# Altium schematic sheet Brightside_Telemetry_RC_rev2.SchDoc
size A4
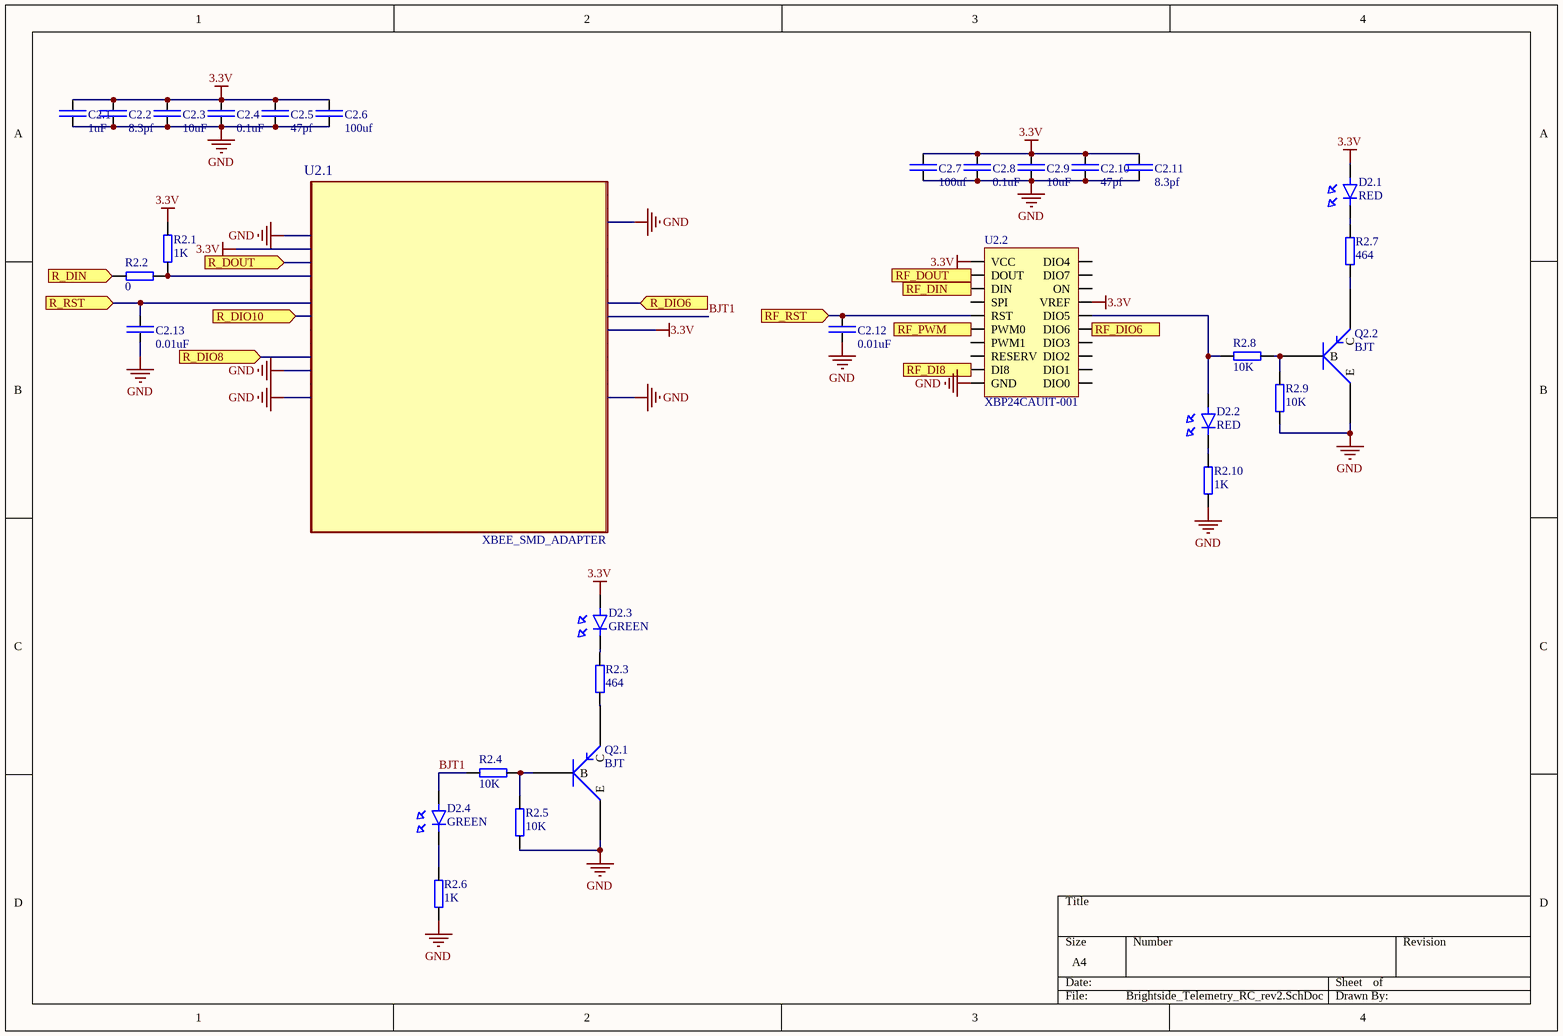
[diagram p0: Brightside_Telemetry_RC_rev2.SchDoc]

## Parts
C2.1  1uF  [C0805]
C2.2  8.3pf  [0603]
C2.3  10uF  [C0805]
C2.4  0.1uF  [0805]
C2.5  47pf  [0603]
C2.6  100uf  [1206]
C2.7  100uf  [1206]
C2.8  0.1uF  [0805]
C2.9  10uF  [C0805]
C2.10  47pf  [0603]
C2.11  8.3pf  [0603]
C2.12  0.01uF  [0805]
C2.13  0.01uF  [0805]
D2.1  RED  [0603 LED]
D2.2  RED  [0603 LED]
D2.3  GREEN  [0603 LED]
D2.4  GREEN  [0603 LED]
Q2.1  BJT  [SOT-23-3]
Q2.2  BJT  [SOT-23-3]
R2.1  1K  [R0805]
R2.2  0  [0805]
R2.3  464  [R0805]
R2.4  10K  [R0805]
R2.5  10K  [R0805]
R2.6  1K  [R0805]
R2.7  464  [R0805]
R2.8  10K  [R0805]
R2.9  10K  [R0805]
R2.10  1K  [R0805]
U2.1  XBEE_SMD_ADAPTER  [XBEE_RF_ADAPT]
U2.2  XBP24CAUIT-001  [XBEE_RF]

## Ports
R_DIN (in), R_DIO6 (in), R_DIO8 (in), R_DIO10 (in), R_DOUT (in), R_RST (in), RF_DI8 (in), RF_DIN (in), RF_DIO6 (in), RF_DOUT (in), RF_PWM (in), RF_RST (in)

## Nets
3.3V: C2.1.2 C2.2.2 C2.3.2 C2.4.2 C2.5.1 C2.6.2 C2.7.2 C2.8.1 C2.9.2 C2.10.2 C2.11.2 D2.1.2 D2.3.2 R2.1.2 U2.1.2(P$2) U2.1.27(P$27) U2.2.1(VCC) U2.2.14(VREF)
GND: C2.1.1 C2.2.1 C2.3.1 C2.4.1 C2.5.2 C2.6.1 C2.7.1 C2.8.2 C2.9.1 C2.10.1 C2.11.1 C2.12.2 C2.13.1 Q2.1.3(E) Q2.2.3(E) R2.5.1 R2.6.1 R2.9.1 R2.10.1 U2.1.1(P$1) U2.1.11(P$11) U2.1.13(P$13) U2.1.22(P$22) U2.1.35(P$35) U2.2.10(GND)
BJT1: D2.4.2 R2.4.1 U2.1.28(P$28)
R_DIN: R2.2.1 ; port R_DIN
R_DIO6: U2.1.29(P$29) ; port R_DIO6
R_DIO8: U2.1.10(P$10) ; port R_DIO8
R_DIO10: U2.1.7(P$7) ; port R_DIO10
R_DOUT: U2.1.3(P$3) ; port R_DOUT
R_RST: C2.13.2 U2.1.6(P$6) ; port R_RST
RF_DI8: U2.2.9(DI8) ; port RF_DI8
RF_DIN: U2.2.3(DIN) ; port RF_DIN
RF_DIO6: U2.2.16(DIO6) ; port RF_DIO6
RF_DOUT: U2.2.2(DOUT) ; port RF_DOUT
RF_PWM: U2.2.6(PWM0) ; port RF_PWM
RF_RST: C2.12.1 U2.2.5(RST) ; port RF_RST
NetD2.1_1: D2.1.1 R2.7.2
NetD2.2_1: D2.2.1 R2.10.2
NetD2.2_2: D2.2.2 R2.8.1 U2.2.15(DIO5)
NetD2.3_1: D2.3.1 R2.3.2
NetD2.4_1: D2.4.1 R2.6.2
NetQ2.1_1: Q2.1.1(B) R2.4.2 R2.5.2
NetQ2.1_2: Q2.1.2(C) R2.3.1
NetQ2.2_1: Q2.2.1(B) R2.8.2 R2.9.2
NetQ2.2_2: Q2.2.2(C) R2.7.1
NetR2.1_1: R2.1.1 R2.2.2 U2.1.4(P$4)

Not connected (* = marked no-connect by the designer): U2.1 5(P$5) 8(P$8) 9(P$9) 12(P$12) 14(P$14) 15(P$15) 16(P$16) 17(P$17) 18(P$18) 19(P$19) 20(P$20) 21(P$21) 23(P$23) 24(P$24) 25(P$25) 26(P$26) 30(P$30) 31(P$31) 32(P$32) 33(P$33) 34(P$34) 36(P$36) 37(P$37); U2.2 4(SPI) 7(PWM1) 8(RESERV) 11(DIO4) 12(DIO7) 13(ON) 17(DIO3) 18(DIO2) 19(DIO1) 20(DIO0)

## Library data of the parts
C2.1 = CL21B105KAFNNNE: Cap Ceramic 1uF 25V X7R 10% SMD 0805 125C T/R; Manufacturer: Samsung; Supplier 1: Digi-Key; Supplier Part Number 1: 1276-1066-1-ND; Manufacturer Part Number: CL21B105KAFNNNE; Stock 1: 1606570; Pricing 1: 1 = 0.10000, 10 = 0.07600, 100 = 0.03380, 500 = 0.02416, 1000 = 0.01898 (USD); RoHS: Yes; Mount: Surface Mount; Case/Package: 0805; Contact Plating: Tin; Case Code (Metric): 2012; Case Code (Imperial): 0805; Min Operating Temperature: -55°C; Max Operating Temperature: 125°C; Packaging: Tape and Reel; Package Quantity: 1; Capacitance: 1uF; Tolerance: 10%; Voltage Rating: 25V; Dielectric: X7R; Voltage: 25V; Voltage Rating (DC): 25V; Length: 2mm; Height: 1.25mm; Depth: 1.25mm; Width: 0.049inch; Thickness: 0.053inch; Radiation Hardening: No; Lead Free: Lead Free; ComponentLink1URL: https://datasheet.ciiva.com/25800/cl21b105kafnnne-25800163.pdf?src-supplier=Digi-Key; ComponentLink1Description: https://datasheet.ciiva.com/25800/cl21b105kafnnne-25800163.pdf?src-supplier=Digi-Key; ComponentLink2URL: https://datasheet.ciiva.com/15195/getdatasheetpartid-355205-15195880.pdf?src-supplier=Verical; ComponentLink2Description: https://datasheet.ciiva.com/15195/getdatasheetpartid-355205-15195880.pdf?src-supplier=Verical; Category: Capacitors
C2.2 C2.11 = CBR06C839BAGAC: CAP CER RF 8.3PF 250V +/-0.1 PF; Manufacturer: KEMET; Supplier 1: Digi-Key; Manufacturer Part Number: CBR06C839BAGAC; RoHS: No; Category: Ceramic Capacitors; Stock 1: 2499; Pricing 1: 1=0.93000, 10=0.68500, 100=0.46970, 500=0.37184, 1000=0.31312 (USD); Supplier Part Number 1: 399-16262-1-ND
C2.3 C2.9 = C0805C106K8PACTU: CAP CER 10UF 10V X5R 0805; Manufacturer: Samsung; Manufacturer Part Number: CL21B105KAFNNNE; Capacitance: 1uF; Tolerance: 10%; Voltage Rating: 25V; Dielectric: X7R; RoHS: Yes; Mount: Surface Mount; Case/Package: 0805; Contact Plating: Tin; Case Code (Metric): 2012; Case Code (Imperial): 0805; Min Operating Temperature: -55°C; Max Operating Temperature: 125°C; Packaging: Tape and Reel; Package Quantity: 1; Voltage: 25V; Voltage Rating (DC): 25V; Length: 2mm; Height: 1.25mm; Depth: 1.25mm; Width: 0.049inch; Thickness: 0.053inch; Radiation Hardening: No; Lead Free: Lead Free; Category: Capacitors; ComponentLink1Description: https://www.digikey.ca/product-detail/en/kemet/C0805C106K8PACTU/399-4925-1-ND/1090920; ComponentLink1URL: https://www.digikey.ca/product-detail/en/kemet/C0805C106K8PACTU/399-4925-1-ND/1090920; Supplier 1: Digi-Key; Supplier Part Number 1: 399-4925-1-ND
C2.4 C2.8 = CL21B104MBCNNNC: Cap Ceramic 0.1uF 50V X7R 20% SMD 0805 125C Paper T/R; Manufacturer: Samsung; Capacitance: 100nF; Supplier 1: Newark; Supplier Part Number 1: 82AC9432; Manufacturer Part Number: CL21B104MBCNNNC; RoHS: Yes; Category: Ceramic Capacitors; Stock 1: 64000; Pricing 1: 4000=0.01100, 8000=0.01000 (CAD); Mount: Surface Mount; Case/Package: 0805; Case Code (Imperial): 0805; Case Code (Metric): 2012; Min Operating Temperature: -55°C; Max Operating Temperature: 125°C; Tolerance: 20%; Dielectric: X7R; Voltage: 50V; Package Quantity: 1; Packaging: Tape and Reel; Voltage Rating: 50V; Voltage Rating (DC): 50V; Length: 2mm; Height: 0.85mm; Depth: 1.25mm; Width: 0.049inch; Thickness: 0.037inch; Radiation Hardening: No; Lead Free: Lead Free; ComponentLink1URL: https://datasheet.ciiva.com/16428/cl21b104mbcnnnc-16428869.pdf?src-supplier=Future+Electronics; ComponentLink1Description: https://datasheet.ciiva.com/16428/cl21b104mbcnnnc-16428869.pdf?src-supplier=Future+Electronics; ComponentLink2URL: https://datasheet.ciiva.com/26838/getdatasheetpartid-746552-26838664.pdf?src-supplier=Verical; ComponentLink2Description: https://datasheet.ciiva.com/26838/getdatasheetpartid-746552-26838664.pdf?src-supplier=Verical; ComponentLink3URL: https://datasheet.ciiva.com/25780/cl21b104mbcnnnc-25780224.pdf?src-supplier=Digi-Key; ComponentLink3Description: https://datasheet.ciiva.com/25780/cl21b104mbcnnnc-25780224.pdf?src-supplier=Digi-Key
C2.5 C2.10 = C0603C470J1GACTU: CAP CER 47PF 100V C0G/NP0 0603; Manufacturer: KEMET; Dielectric Material: Ceramic; Tolerance: 5%; Dielectric: C0G; Temperature Coefficient: 30ppm/°C; Dissipation Factor: 0.1%; Supplier 1: Digi-Key; Manufacturer Part Number: C0603C470J1GACTU; RoHS: Yes; Category: Ceramic Capacitors; Stock 1: 141401; Pricing 1: 1=0.10000, 10=0.06000, 100=0.02670, 500=0.01906, 1000=0.01497 (USD); Mount: Surface Mount,PCB; Case/Package: 0603; Number of Pins: 2; Case Code (Imperial): 0603; Case Code (Metric): 1608; Min Operating Temperature: -55°C; Max Operating Temperature: 125°C; Capacitance: 47pF; Package Quantity: 4000; Voltage Rating: 100V; Voltage Rating (DC): 100V; Packaging: Tape and Reel; Termination: SMD/SMT; Voltage: 100V; Length: 1.6mm; Height: 0.8mm; Width: 0.8mm; Lead Pitch: 0.7mm; Thickness: 0.034inch; Depth: 0.8mm; Radiation Hardening: No; REACH SVHC: No SVHC; Lead Free: Lead Free; ComponentLink1URL: https://datasheet.ciiva.com/28668/1789732-28668693.pdf?src-supplier=Element14; ComponentLink1Description: https://datasheet.ciiva.com/28668/1789732-28668693.pdf?src-supplier=Element14; ComponentLink2URL: https://datasheet.ciiva.com/18193/getdatasheetpartid-544691-18193046.pdf?src-supplier=Verical; ComponentLink2Description: https://datasheet.ciiva.com/18193/getdatasheetpartid-544691-18193046.pdf?src-supplier=Verical; ComponentLink3URL: https://datasheet.ciiva.com/18101/getdatasheetpartid-38001-18101098.pdf?src-supplier=Verical; ComponentLink3Description: https://datasheet.ciiva.com/18101/getdatasheetpartid-38001-18101098.pdf?src-supplier=Verical; Supplier Part Number 1: 399-7917-1-ND
C2.6 C2.7 = GRM21BR60G107ME15L: Cap Ceramic 100uF 6.3V X5R 20% SMD 1206 85°C Embossed T/R; Manufacturer: Murata; Voltage Rating (DC): 4V; Dissipation Factor: 0.1%; Description: Multilayer Ceramic Capacitors MLCC - SMD/SMT 100uF 4Volts X5R 20%; Supplier 1: Digi-Key; Manufacturer Part Number: GRM21BR60G107ME15L; RoHS: Yes; Category: Ceramic Capacitors; Pricing 1: 1=1.07000, 10=0.84100, 100=0.63070, 500=0.47656, 1000=0.42049 (USD); Mount: Surface Mount; Case/Package: 0805; Weight: 0.000335oz; Case Code (Metric): 2012; Case Code (Imperial): 0805; Dielectric Material: Ceramic; Min Operating Temperature: -55°C; Max Operating Temperature: 85°C; Tolerance: 20%; Dielectric: X5R; Packaging: Tape and Reel; Voltage Rating: 4V; Voltage: 4V; Termination: SMD/SMT; Package Quantity: 3000; Capacitance: 100uF; Length: 2mm; Height: 1.25mm; Width: 0.049inch; Thickness: 0.057inch; Depth: 1.25mm; REACH SVHC: No SVHC; Lead Free: Lead Free; ComponentLink1URL: http://www.farnell.com/datasheets/2079181.pdf?src-supplier=Farnell; ComponentLink1Description: http://www.farnell.com/datasheets/2079181.pdf?src-supplier=Farnell; ComponentLink2URL: http://www.mouser.com/ds/2/281/c02e-2905.pdf?src-supplier=Mouser; ComponentLink2Description: http://www.mouser.com/ds/2/281/c02e-2905.pdf?src-supplier=Mouser; ComponentLink3URL: http://psearch.en.murata.com/capacitor/product/GRM21BR60G107ME15%23.pdf?src-supplier=Avnet; ComponentLink3Description: http://psearch.en.murata.com/capacitor/product/GRM21BR60G107ME15%23.pdf?src-supplier=Avnet; ComponentLink4URL: http://www.farnell.com/datasheets/2079181.pdf?src-supplier=Element14; ComponentLink4Description: http://www.farnell.com/datasheets/2079181.pdf?src-supplier=Element14; ComponentLink5URL: https://search.murata.co.jp/Ceramy/image/img/A01X/partnumbering_e_01.pdf?src-supplier=Digi-Key; ComponentLink5Description: https://search.murata.co.jp/Ceramy/image/img/A01X/partnumbering_e_01.pdf?src-supplier=Digi-Key; ComponentLink6URL: http://www.farnell.com/datasheets/2079181.pdf?src-supplier=Newark; ComponentLink6Description: http://www.farnell.com/datasheets/2079181.pdf?src-supplier=Newark; Supplier Part Number 1: 490-10510-1-ND; Supplier 2: Digi-Key; Supplier Part Number 2: 490-7216-1-ND; Stock 2: 30548; Pricing 2: 1=1.10000, 10=0.86800, 100=0.65120, 500=0.49204, 1000=0.43415 (USD); Material: Ceramic; ComponentLink7URL: https://datasheet.ciiva.com/5418/product-5418275.pdf?src-supplier=Mouser; ComponentLink7Description: https://datasheet.ciiva.com/5418/product-5418275.pdf?src-supplier=Mouser; ComponentLink8URL: https://datasheet.ciiva.com/15027/product-15027946.pdf?src-supplier=Digi-Key; ComponentLink8Description: https://datasheet.ciiva.com/15027/product-15027946.pdf?src-supplier=Digi-Key; ComponentLink9URL: https://datasheet.ciiva.com/15027/product-15027947.pdf?src-supplier=Digi-Key; ComponentLink9Description: https://datasheet.ciiva.com/15027/product-15027947.pdf?src-supplier=Digi-Key; Supplier 3: Digi-Key; Supplier Part Number 3: 1276-1782-6-ND; Pricing 3: 1=0.62000, 10=0.43900, 100=0.28930, 500=0.21430, 1000=0.18216 (USD); Contact Plating: Tin; Radiation Hardening: No; ComponentLink10URL: https://datasheet.ciiva.com/25723/cl31a107mqhnnne-25723159.pdf?src-supplier=Digi-Key; ComponentLink10Description: https://datasheet.ciiva.com/25723/cl31a107mqhnnne-25723159.pdf?src-supplier=Digi-Key; ComponentLink11URL: https://datasheet.ciiva.com/16437/cl31a107mqhnnne-16437212.pdf?src-supplier=Future+Electronics; ComponentLink11Description: https://datasheet.ciiva.com/16437/cl31a107mqhnnne-16437212.pdf?src-supplier=Future+Electronics; ComponentLink12URL: https://datasheet.ciiva.com/15195/getdatasheetpartid-358449-15195997.pdf?src-supplier=Verical; ComponentLink12Description: https://datasheet.ciiva.com/15195/getdatasheetpartid-358449-15195997.pdf?src-supplier=Verical; ComponentLink13URL: https://datasheet.ciiva.com/29201/452463-da-01-en-vs-kondensator-1206-29201265.pdf?src-supplier=Conrad; ComponentLink13Description: https://datasheet.ciiva.com/29201/452463-da-01-en-vs-kondensator-1206-29201265.pdf?src-supplier=Conrad; ComponentLink14URL: https://datasheet.ciiva.com/20173/71-0886-20173093.pdf?src-supplier=Rapid+Electronics; ComponentLink14Description: https://datasheet.ciiva.com/20173/71-0886-20173093.pdf?src-supplier=Rapid+Electronics
C2.12 C2.13 = C0805C103K1RAC7210: Cap Ceramic 0.01uF 100V X7R 10% SMD 0805 125C T/R; Manufacturer: KEMET; Capacitance: 10nF; Supplier 1: Digi-Key; Supplier Part Number 1: 399-17617-1-ND; Manufacturer Part Number: C0805C103K1RAC7210; RoHS: Yes; Category: Ceramic Capacitors; Stock 1: 43378; Mount: Surface Mount; Case/Package: 0805; Case Code (Imperial): 0805; Case Code (Metric): 2012; Dielectric Material: Ceramic; Min Operating Temperature: -55°C; Max Operating Temperature: 125°C; Dielectric: X7R; Tolerance: 10%; Termination: SMD/SMT; Packaging: Tape and Reel; Package Quantity: 10000; Voltage Rating: 100V; Voltage Rating (DC): 100V; Length: 2mm; Height: 0.78mm; Depth: 1.25mm; Radiation Hardening: No; ComponentLink1URL: http://www.mouser.com/ds/2/212/KEM_C1002_X7R_SMD-1102033.pdf?src-supplier=Mouser; ComponentLink1Description: http://www.mouser.com/ds/2/212/KEM_C1002_X7R_SMD-1102033.pdf?src-supplier=Mouser; ComponentLink2URL: https://www.verical.com/server-webapp/html/getDatasheet?partID=131027&src-supplier=Verical; ComponentLink2Description: https://www.verical.com/server-webapp/html/getDatasheet?partID=131027&src-supplier=Verical; ComponentLink3URL: http://components.arrow.com/part/dataview/0323_00324583?src-supplier=Arrow+Europe; ComponentLink3Description: http://components.arrow.com/part/dataview/0323_00324583?src-supplier=Arrow+Europe; ComponentLink4URL: http://www.farnell.com/datasheets/2747800.pdf?src-supplier=Farnell; ComponentLink4Description: http://www.farnell.com/datasheets/2747800.pdf?src-supplier=Farnell; ComponentLink5URL: http://components.arrow.com/part/dataview/2091052S6675795N7429?src-supplier=Arrow; ComponentLink5Description: http://components.arrow.com/part/dataview/2091052S6675795N7429?src-supplier=Arrow; ComponentLink6URL: http://www.farnell.com/datasheets/2747800.pdf?src-supplier=Newark; ComponentLink6Description: http://www.farnell.com/datasheets/2747800.pdf?src-supplier=Newark; ComponentLink7URL: http://www.kemet.com/kemet/web/homepage/kechome.nsf/weben/C4DA2DA1D1C9D3C3CA2570A50016092D/$file/KEM_C1002_X7R_SMD.pdf?src-supplier=Avnet+Europe; ComponentLink7Description: http://www.kemet.com/kemet/web/homepage/kechome.nsf/weben/C4DA2DA1D1C9D3C3CA2570A50016092D/$file/KEM_C1002_X7R_SMD.pdf?src-supplier=Avnet+Europe; ComponentLink8URL: http://www.kemet.com/kemet/web/homepage/kechome.nsf/weben/C4DA2DA1D1C9D3C3CA2570A50016092D/$file/KEM_C1002_X7R_SMD.pdf?src-supplier=Avnet; ComponentLink8Description: http://www.kemet.com/kemet/web/homepage/kechome.nsf/weben/C4DA2DA1D1C9D3C3CA2570A50016092D/$file/KEM_C1002_X7R_SMD.pdf?src-supplier=Avnet; ComponentLink9URL: https://api.kemet.com/component-edge/download/datasheet/C0805C103K1RAC7210.pdf?src-supplier=Digi-Key; ComponentLink9Description: https://api.kemet.com/component-edge/download/datasheet/C0805C103K1RAC7210.pdf?src-supplier=Digi-Key
D2.1 D2.2 = 150060RS75000: WURTH ELEKTRONIK - 150060RS75000 - LED, Red, 625 nm, 2 V, 30 mA, 250 mcd RoHS Compliant: Yes; Manufacturer: Wurth Electronics; Viewing Angle: 140°; Lens Style: Clear,Rectangular; Luminous Intensity: 250mcd; Forward Current: 30mA; Forward Voltage: 2V; Wavelength: 625nm; Test Current: 20mA; Supplier 1: Digi-Key; Supplier Part Number 1: 732-4978-1-ND; Manufacturer Part Number: 150060RS75000; RoHS: Yes; Category: LEDs; Stock 1: 19381; Mount: Surface Mount; Case/Package: 0603; Case Code (Imperial): 0603; Color: Red; Case Code (Metric): 1608; Min Operating Temperature: -40°C; Max Operating Temperature: 85°C; Package Quantity: 1; Packaging: Cut Tape; Dominant Wavelength: 625nm; Length: 1.6mm; Height: 0.7mm; Width: 0.8mm; REACH SVHC: Unknown; ComponentLink1URL: https://datasheet.ciiva.com/29563/150060rs75000-29563040.pdf?src-supplier=Digi-Key; ComponentLink1Description: https://datasheet.ciiva.com/29563/150060rs75000-29563040.pdf?src-supplier=Digi-Key; ComponentLink2URL: https://datasheet.ciiva.com/29279/759428-da-01-en-chipled-0603-w-kl-rot-150060rs75000-29279196.pdf?src-supplier=Conrad; ComponentLink2Description: https://datasheet.ciiva.com/29279/759428-da-01-en-chipled-0603-w-kl-rot-150060rs75000-29279196.pdf?src-supplier=Conrad
D2.3 D2.4 = 150060VS75000: WURTH ELEKTRONIK - 150060VS75000 - LED, Grün, Oberflächenmontage, 603, 30 mA, 2 V, 570 nm; Manufacturer: Wurth Electronics; Luminous Intensity: 40mcd; Viewing Angle: 140°; Forward Voltage: 2V; Wavelength: 570nm; Lens Style: Clear,Rectangular; Forward Current: 30mA; Test Current: 20mA; Supplier 1: Digi-Key; Supplier Part Number 1: 732-4980-1-ND; Manufacturer Part Number: 150060VS75000; RoHS: Yes; Category: LEDs; Stock 1: 29022; Mount: Surface Mount; Case/Package: 0603; Number of Pins: 2; Case Code (Metric): 1608; Case Code (Imperial): 0603; Color: Green; Min Operating Temperature: -40°C; Max Operating Temperature: 85°C; Package Quantity: 1; Packaging: Tape and Reel; Dominant Wavelength: 570nm; Length: 1.6mm; Height: 0.7mm; Width: 0.8mm; REACH SVHC: Unknown; ComponentLink1URL: https://datasheet.ciiva.com/29562/150060vs75000-29562919.pdf?src-supplier=Digi-Key; ComponentLink1Description: https://datasheet.ciiva.com/29562/150060vs75000-29562919.pdf?src-supplier=Digi-Key
Q2.1 Q2.2 = MMBT3904LT1G: Transistor, Bipolar, Si, NPN, General Purpose, VCEO 40VDC, IC 200mA, PD 225mW, SOT-23; Manufacturer: ON Semiconductor; Max Power Dissipation: 300mW; Number of Elements: 1; Frequency: 300MHz; hFE Min: 100; Collector Emitter Voltage (VCEO): 40V; Collector Base Voltage (VCBO): 60V; Emitter Base Voltage (VEBO): 6V; Collector Emitter Saturation Voltage: 300mV; Element Configuration: Single; Supplier 1: Digi-Key; Manufacturer Part Number: MMBT3904LT1G; RoHS: Yes; Category: BJTs; Stock 1: 1679516; Pricing 1: 1=0.12000, 10=0.11200, 25=0.10640, 100=0.04680, 250=0.04488, 500=0.03672, 1000=0.02550 (USD); Case/Package: SOT-23-3; Number of Pins: 3; Contact Plating: Tin,Matte; Min Operating Temperature: -55°C; Max Operating Temperature: 150°C; Package Quantity: 1; Packaging: Tape and Reel; Max Collector Current: 200mA; Transition Frequency: 300MHz; Polarity: NPN; Collector Emitter Breakdown Voltage: 40V; Max Breakdown Voltage: 40V; Power Dissipation: 300mW; Gain Bandwidth Product: 300MHz; Max Frequency: 300MHz; Voltage Rating (DC): 40V; Current Rating: 200mA; Type: General Purpose; Length: 2.9mm; Height: 0.94mm; Width: 1.3mm; Radiation Hardening: No; REACH SVHC: No SVHC; Lead Free: Lead Free; ComponentLink1URL: https://datasheet.ciiva.com/16199/mmbt3904lt1-d-16199009.pdf?src-supplier=Future+Electronics; ComponentLink1Description: https://datasheet.ciiva.com/16199/mmbt3904lt1-d-16199009.pdf?src-supplier=Future+Electronics; ComponentLink2URL: https://datasheet.ciiva.com/4723/mmbt3904lt1-d-113169-4723050.pdf?src-supplier=Mouser; ComponentLink2Description: https://datasheet.ciiva.com/4723/mmbt3904lt1-d-113169-4723050.pdf?src-supplier=Mouser; ComponentLink3URL: https://datasheet.ciiva.com/15138/getdatasheetpartid-53263-15138779.pdf?src-supplier=Verical; ComponentLink3Description: https://datasheet.ciiva.com/15138/getdatasheetpartid-53263-15138779.pdf?src-supplier=Verical; ComponentLink4URL: https://datasheet.ciiva.com/11199/mmbt3904lt1-d-11199003.pdf?src-supplier=Avnet; ComponentLink4Description: https://datasheet.ciiva.com/11199/mmbt3904lt1-d-11199003.pdf?src-supplier=Avnet; ComponentLink5URL: https://datasheet.ciiva.com/976/mmbt3904lt1-d-976364.pdf?src-supplier=Digi-Key; ComponentLink5Description: https://datasheet.ciiva.com/976/mmbt3904lt1-d-976364.pdf?src-supplier=Digi-Key; ComponentLink6URL: https://datasheet.ciiva.com/14546/70099530-14546188.pdf?src-supplier=Allied+Electronics; ComponentLink6Description: https://datasheet.ciiva.com/14546/70099530-14546188.pdf?src-supplier=Allied+Electronics; ComponentLink7URL: https://datasheet.ciiva.com/7972/1708269-7972381.pdf?src-supplier=Element14; ComponentLink7Description: https://datasheet.ciiva.com/7972/1708269-7972381.pdf?src-supplier=Element14; ComponentLink8URL: https://datasheet.ciiva.com/22664/1708269-22664159.pdf?src-supplier=Element14; ComponentLink8Description: https://datasheet.ciiva.com/22664/1708269-22664159.pdf?src-supplier=Element14; ComponentLink9URL: https://datasheet.ciiva.com/976/mmbt3904lt1-d-976362.pdf?src-supplier=Digi-Key; ComponentLink9Description: https://datasheet.ciiva.com/976/mmbt3904lt1-d-976362.pdf?src-supplier=Digi-Key; ComponentLink10URL: https://datasheet.ciiva.com/16478/mmbt3904lt1-d-16478538.pdf?src-supplier=Avnet+Asia; ComponentLink10Description: https://datasheet.ciiva.com/16478/mmbt3904lt1-d-16478538.pdf?src-supplier=Avnet+Asia; ComponentLink11URL: https://datasheet.ciiva.com/976/mmbt3904lt1-d-976363.pdf?src-supplier=Digi-Key; ComponentLink11Description: https://datasheet.ciiva.com/976/mmbt3904lt1-d-976363.pdf?src-supplier=Digi-Key; Supplier Part Number 1: MMBT3904LT1GOSCT-ND
R2.1 R2.6 R2.10 = ERJ6ENF1001V: RES SMD 1K OHM 1% 1/8W 0805; Manufacturer: Panasonic; Resistance: 1kR; Power Rating: 125mW; Temperature Coefficient: 100ppm/°C; Voltage Rating (DC): 150V; Supplier 1: Digi-Key; Supplier Part Number 1: P1.00KCCT-ND; Manufacturer Part Number: ERJ6ENF1001V; Stock 1: 946321; Pricing 1: 1 = 0.100000, 10 = 0.081000, 100 = 0.031100, 1000 = 0.013670, 2500 = 0.011810 (USD); RoHS: Yes; Mount: Surface Mount; Case/Package: 0805; Number of Pins: 2; Case Code (Metric): 2012; Case Code (Imperial): 0805; Contact Plating: Tin; Min Operating Temperature: -55°C; Max Operating Temperature: 155°C; Tolerance: 1%; Packaging: Tape and Reel; Number of Terminations: 2; Package Quantity: 1; Voltage Rating: 150V; Composition: Thick Film; Termination: SMD/SMT; Military Standard: Not; Max Power Dissipation: 125mW; Features: Automotive AEC-Q200; Length: 2mm; Height: 0.6mm; Width: 0.049inch; Depth: 1.25mm; Radiation Hardening: No; REACH SVHC: No SVHC; Lead Free: Lead Free; ComponentLink1URL: https://datasheet.ciiva.com/34303/1988962-34303619.pdf?src-supplier=Jameco; ComponentLink1Description: https://datasheet.ciiva.com/34303/1988962-34303619.pdf?src-supplier=Jameco; ComponentLink2URL: https://datasheet.ciiva.com/11808/0900766b80f80784-11808500.pdf?src-supplier=RSComponents; ComponentLink2Description: https://datasheet.ciiva.com/11808/0900766b80f80784-11808500.pdf?src-supplier=RSComponents; ComponentLink3URL: https://datasheet.ciiva.com/28532/426256-28532134.pdf?src-supplier=Element14; ComponentLink3Description: https://datasheet.ciiva.com/28532/426256-28532134.pdf?src-supplier=Element14; ComponentLink4URL: https://datasheet.ciiva.com/30051/aoa0000ce2-30051974.pdf?src-supplier=Onlinecomponents.com; ComponentLink4Description: https://datasheet.ciiva.com/30051/aoa0000ce2-30051974.pdf?src-supplier=Onlinecomponents.com; ComponentLink5URL: https://datasheet.ciiva.com/16774/70260748-16774249.pdf?src-supplier=Allied+Electronics; ComponentLink5Description: https://datasheet.ciiva.com/16774/70260748-16774249.pdf?src-supplier=Allied+Electronics; ComponentLink6URL: https://datasheet.ciiva.com/46373/1678782-46373337.pdf?src-supplier=Element14; ComponentLink6Description: https://datasheet.ciiva.com/46373/1678782-46373337.pdf?src-supplier=Element14; ComponentLink7URL: https://datasheet.ciiva.com/46373/1678782-46373338.pdf?src-supplier=Element14; ComponentLink7Description: https://datasheet.ciiva.com/46373/1678782-46373338.pdf?src-supplier=Element14; ComponentLink8URL: https://datasheet.ciiva.com/48532/aoa0000ce2-48532156.pdf?src-supplier=Avnet; ComponentLink8Description: https://datasheet.ciiva.com/48532/aoa0000ce2-48532156.pdf?src-supplier=Avnet; ComponentLink9URL: https://datasheet.ciiva.com/7942/426256-7942429.pdf?src-supplier=Element14; ComponentLink9Description: https://datasheet.ciiva.com/7942/426256-7942429.pdf?src-supplier=Element14; ComponentLink10URL: https://datasheet.ciiva.com/16199/aoa0000ce2-16199262.pdf?src-supplier=Future+Electronics; ComponentLink10Description: https://datasheet.ciiva.com/16199/aoa0000ce2-16199262.pdf?src-supplier=Future+Electronics; ComponentLink11URL: https://datasheet.ciiva.com/9117/aoa0000ce2-9117391.pdf?src-supplier=Avnet; ComponentLink11Description: https://datasheet.ciiva.com/9117/aoa0000ce2-9117391.pdf?src-supplier=Avnet; ComponentLink12URL: https://datasheet.ciiva.com/16523/aoa0000ce2-16523855.pdf?src-supplier=Avnet+Asia; ComponentLink12Description: https://datasheet.ciiva.com/16523/aoa0000ce2-16523855.pdf?src-supplier=Avnet+Asia; Category: Resistors
R2.2 = RMCF0805ZT0R00: STACKPOLE ELECTRONICS - RMCF0805ZT0R00. - RES THKFLM 0805 0 OHM JUMPER 1/8W 200PPM/ C SMD ROHS COMPLIANT: YES; Resistance: 0mR; Power Rating: 125mW; Supplier 1: Digi-Key; Supplier Part Number 1: RMCF0805ZT0R00CT-ND; Manufacturer: Stackpole Electronics; Manufacturer Part Number: RMCF0805ZT0R00; RoHS: Yes; Category: Chip SMD Resistors; Stock 1: 14305; Mount: Surface Mount; Case/Package: 0805; Case Code (Metric): 2012; Case Code (Imperial): 0805; Contact Plating: Tin,Matte; Min Operating Temperature: -55°C; Max Operating Temperature: 155°C; Packaging: Tape and Reel; Features: Automotive AEC-Q200; Composition: Thick Film; Number of Terminations: 2; Military Standard: Not; Max Power Dissipation: 125mW; Length: 2mm; Height: 0.026inch; Width: 0.049inch; Depth: 1.25mm; Radiation Hardening: No; Lead Free: Lead Free; ComponentLink1URL: https://datasheet.ciiva.com/15193/getdatasheetpartid-360417-15193658.pdf?src-supplier=Verical; ComponentLink1Description: https://datasheet.ciiva.com/15193/getdatasheetpartid-360417-15193658.pdf?src-supplier=Verical
R2.3 R2.7 = ERJ6ENF4640V: RES SMD 464 OHM 1% 1/8W 0805; Supplier 1: Digi-Key; Supplier Part Number 1: P464CCT-ND
R2.4 R2.5 R2.8 R2.9 = ERJ6ENF1002V: RES SMD 10K OHM 1% 1/8W 0805; Manufacturer: Yageo; Manufacturer Part Number: ERJ-6ENF1002V; Temperature Coefficient: 100ppm/°C; Voltage Rating (DC): 150V; Power Rating: 125mW; Resistance: 10000R; Supplier 1: Digi-Key; Supplier Part Number 1: P10.0KCCT-ND; Stock 1: 3342401; Pricing 1: 1 = 0.100000, 10 = 0.081000, 100 = 0.031100, 1000 = 0.013670, 2500 = 0.011810 (USD); RoHS: No; Mount: Surface Mount; Case/Package: 0805; Number of Pins: 2; Min Operating Temperature: -55°C; Max Operating Temperature: 155°C; Packaging: Tape and Reel; Tolerance: 1%; Length: 2mm; Height: 0.5mm; Depth: 1.25mm; Width: 1.25mm; REACH SVHC: No SVHC; Lead Free: Lead Free; ComponentLink1URL: https://datasheet.ciiva.com/27056/2078477-27056611.pdf?src-supplier=Jameco; ComponentLink1Description: https://datasheet.ciiva.com/27056/2078477-27056611.pdf?src-supplier=Jameco; Category: Resistors
U2.1 = XBEE_SMD_ADAPTER: GateName_1: G$1; SymbolName_1: XBEE_SMD_ADAPTER; LibraryName: UBCSolar; DeviceSetName: XBEE_SMD_ADAPTER; Package: XBEE_SMD_ADAPTER
U2.2 = XBP24CAUIT-001: Rf Transceiver Module, 2.4GHZ, -101DBM; Manufacturer: Digi International; Interface: SPI,UART; Data Rate: 1Mbps; Current - Receiving: 31mA; Current - Transmitting: 120mA; Supplier 1: Digi-Key; Manufacturer Part Number: XBP24CAUIT-001; RoHS: No; Category: RF Receivers, Transceivers; Stock 1: 500; Pricing 1: 1=32.56000 (USD); Mount: Through Hole; Case/Package: Module; Min Operating Temperature: -40°C; Max Operating Temperature: 85°C; Packaging: Tray; Frequency: 2.4GHz; Sensitivity: -101dBm; ComponentLink1URL: https://www.digi.com/resources/documentation/digidocs/pdfs/90001500.pdf?src-supplier=Digi-Key; ComponentLink1Description: https://www.digi.com/resources/documentation/digidocs/pdfs/90001500.pdf?src-supplier=Digi-Key; Supplier Part Number 1: 602-1897-ND